# EAGLE schematic MDM_V3_LEDPad_A (EAGLE 6.4)
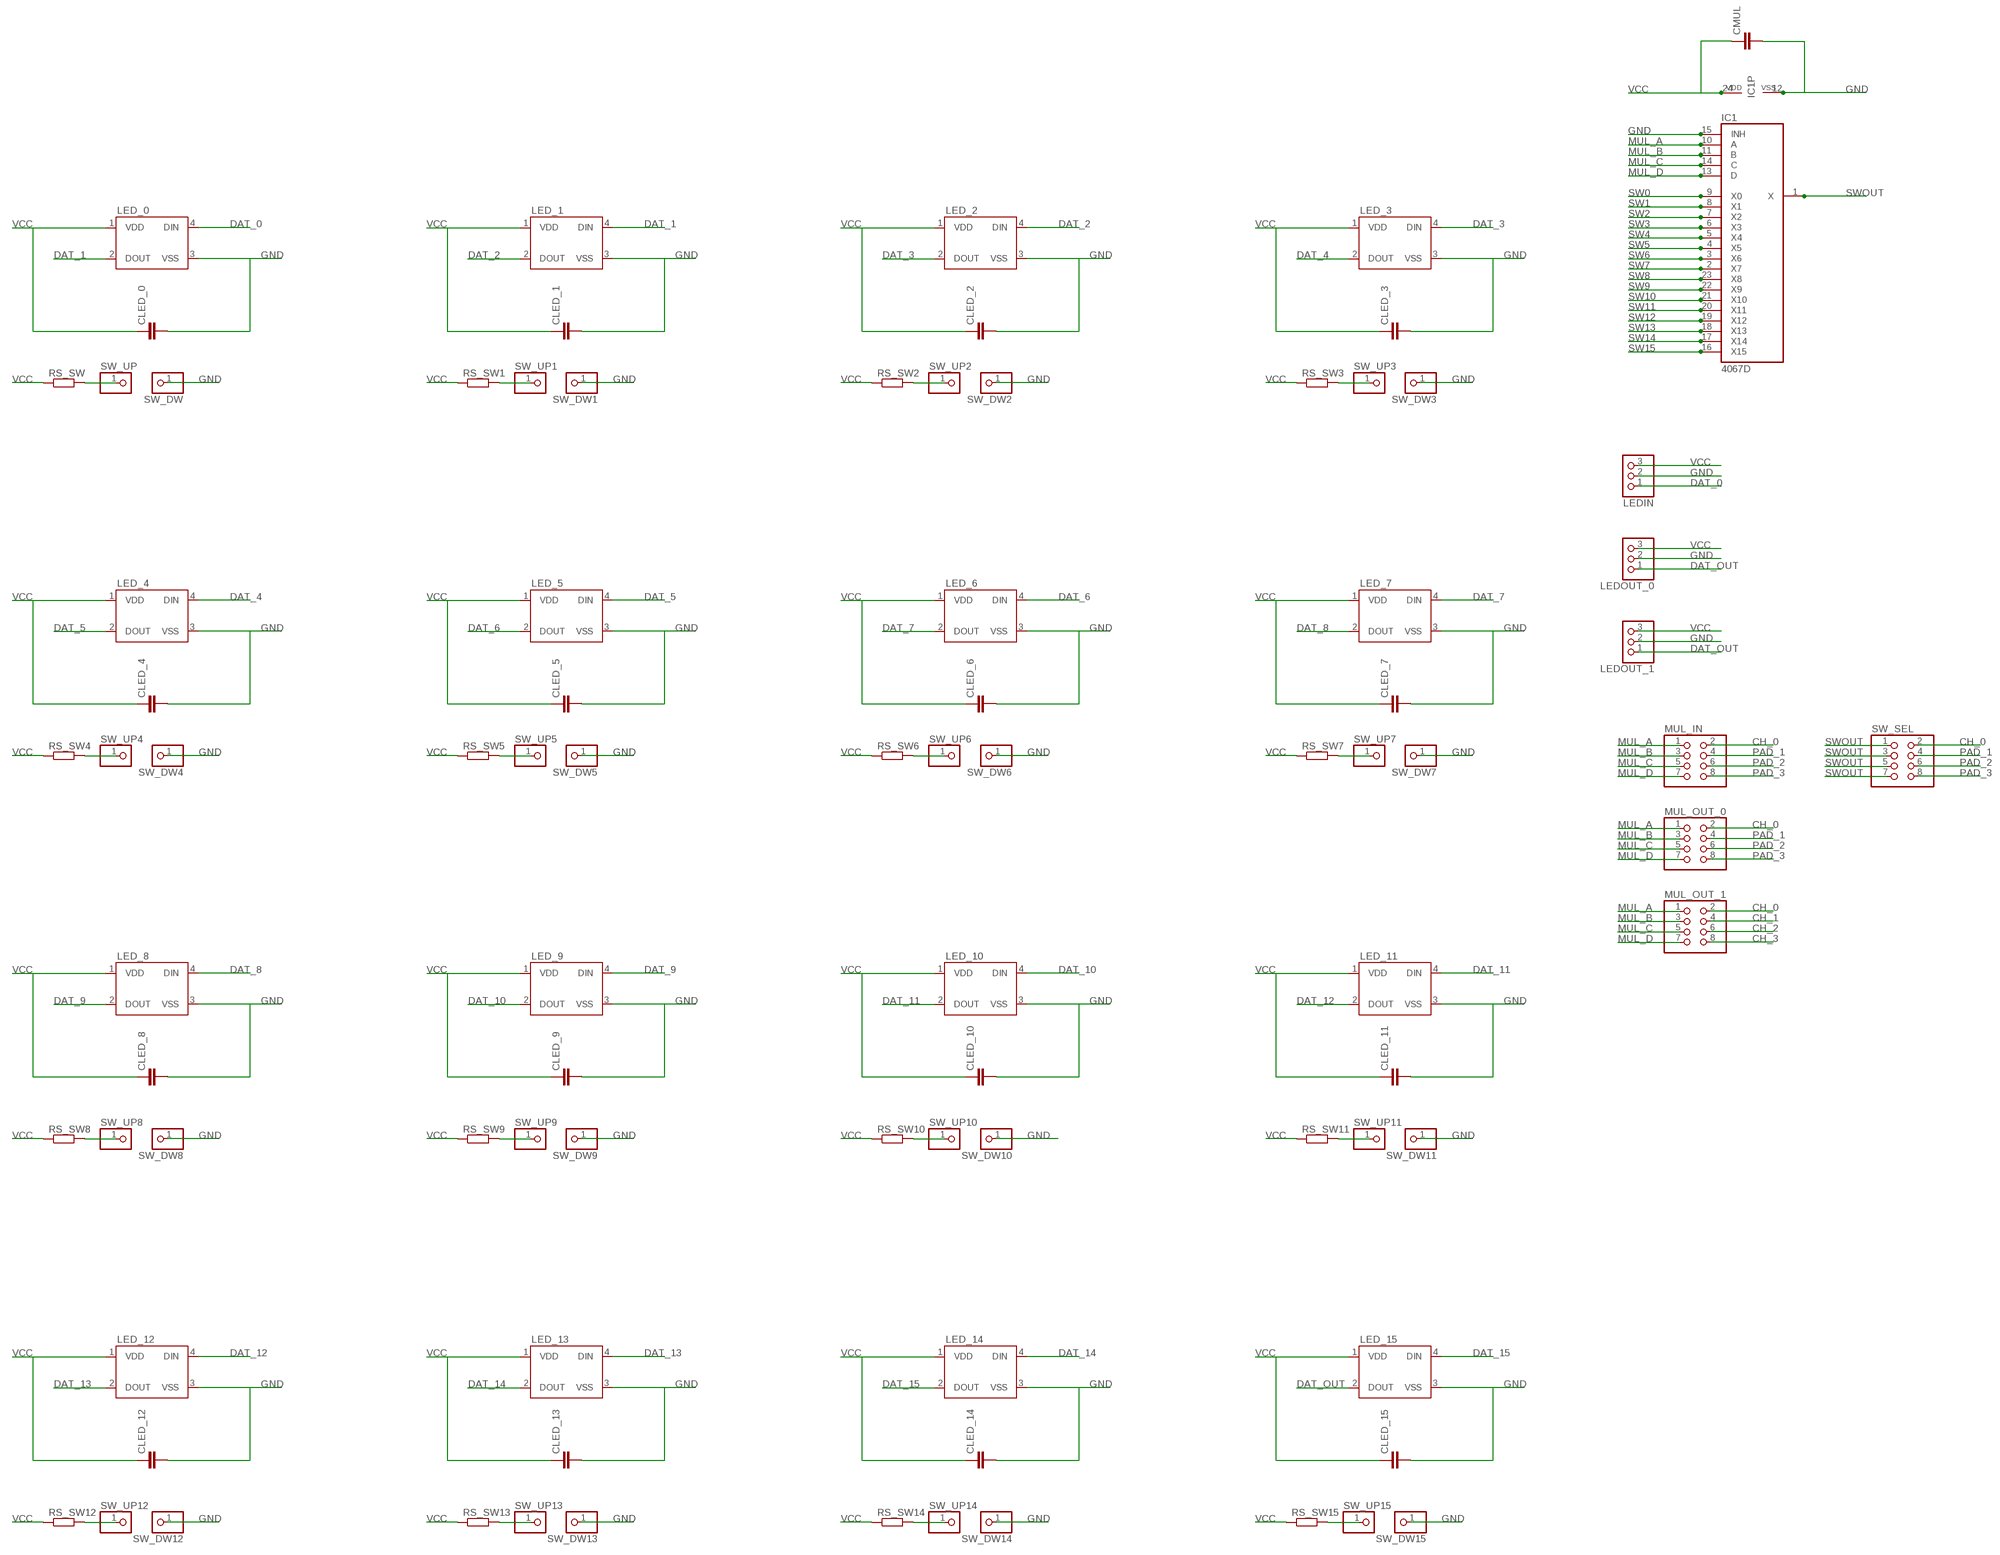
[diagram p0: schematic, sheet 1]

## Parts
CLED_0  C-EUC1206K  [C1206K]
CLED_1  C-EUC1206K  [C1206K]
CLED_2  C-EUC1206K  [C1206K]
CLED_3  C-EUC1206K  [C1206K]
CLED_4  C-EUC1206K  [C1206K]
CLED_5  C-EUC1206K  [C1206K]
CLED_6  C-EUC1206K  [C1206K]
CLED_7  C-EUC1206K  [C1206K]
CLED_8  C-EUC1206K  [C1206K]
CLED_9  C-EUC1206K  [C1206K]
CLED_10  C-EUC1206K  [C1206K]
CLED_11  C-EUC1206K  [C1206K]
CLED_12  C-EUC1206K  [C1206K]
CLED_13  C-EUC1206K  [C1206K]
CLED_14  C-EUC1206K  [C1206K]
CLED_15  C-EUC1206K  [C1206K]
CMUL  C-EUC1206K  [C1206K]
IC1  4067D  [SO24W]
LED_0  WS2812B  [WS2812B]
LED_1  WS2812B  [WS2812B]
LED_2  WS2812B  [WS2812B]
LED_3  WS2812B  [WS2812B]
LED_4  WS2812B  [WS2812B]
LED_5  WS2812B  [WS2812B]
LED_6  WS2812B  [WS2812B]
LED_7  WS2812B  [WS2812B]
LED_8  WS2812B  [WS2812B]
LED_9  WS2812B  [WS2812B]
LED_10  WS2812B  [WS2812B]
LED_11  WS2812B  [WS2812B]
LED_12  WS2812B  [WS2812B]
LED_13  WS2812B  [WS2812B]
LED_14  WS2812B  [WS2812B]
LED_15  WS2812B  [WS2812B]
LEDIN  PINHD-1X3  [1X03]
LEDOUT_0  PINHD-1X3  [1X03]
LEDOUT_1  PINHD-1X3  [1X03]
MUL_IN  PINHD-2X4  [2X04]
MUL_OUT_0  PINHD-2X4  [2X04]
MUL_OUT_1  PINHD-2X4  [2X04]
RS_SW  R-EU_R1206  [R1206]
RS_SW1  R-EU_R1206  [R1206]
RS_SW2  R-EU_R1206  [R1206]
RS_SW3  R-EU_R1206  [R1206]
RS_SW4  R-EU_R1206  [R1206]
RS_SW5  R-EU_R1206  [R1206]
RS_SW6  R-EU_R1206  [R1206]
RS_SW7  R-EU_R1206  [R1206]
RS_SW8  R-EU_R1206  [R1206]
RS_SW9  R-EU_R1206  [R1206]
RS_SW10  R-EU_R1206  [R1206]
RS_SW11  R-EU_R1206  [R1206]
RS_SW12  R-EU_R1206  [R1206]
RS_SW13  R-EU_R1206  [R1206]
RS_SW14  R-EU_R1206  [R1206]
RS_SW15  R-EU_R1206  [R1206]
SW_DW  PINHD-1X1CB  [1X01-CLEANBIG]
SW_DW1  PINHD-1X1CB  [1X01-CLEANBIG]
SW_DW2  PINHD-1X1CB  [1X01-CLEANBIG]
SW_DW3  PINHD-1X1CB  [1X01-CLEANBIG]
SW_DW4  PINHD-1X1CB  [1X01-CLEANBIG]
SW_DW5  PINHD-1X1CB  [1X01-CLEANBIG]
SW_DW6  PINHD-1X1CB  [1X01-CLEANBIG]
SW_DW7  PINHD-1X1CB  [1X01-CLEANBIG]
SW_DW8  PINHD-1X1CB  [1X01-CLEANBIG]
SW_DW9  PINHD-1X1CB  [1X01-CLEANBIG]
SW_DW10  PINHD-1X1CB  [1X01-CLEANBIG]
SW_DW11  PINHD-1X1CB  [1X01-CLEANBIG]
SW_DW12  PINHD-1X1CB  [1X01-CLEANBIG]
SW_DW13  PINHD-1X1CB  [1X01-CLEANBIG]
SW_DW14  PINHD-1X1CB  [1X01-CLEANBIG]
SW_DW15  PINHD-1X1CB  [1X01-CLEANBIG]
SW_SEL  PINHD-2X4  [2X04]
SW_UP  PINHD-1X1CB  [1X01-CLEANBIG]
SW_UP1  PINHD-1X1CB  [1X01-CLEANBIG]
SW_UP2  PINHD-1X1CB  [1X01-CLEANBIG]
SW_UP3  PINHD-1X1CB  [1X01-CLEANBIG]
SW_UP4  PINHD-1X1CB  [1X01-CLEANBIG]
SW_UP5  PINHD-1X1CB  [1X01-CLEANBIG]
SW_UP6  PINHD-1X1CB  [1X01-CLEANBIG]
SW_UP7  PINHD-1X1CB  [1X01-CLEANBIG]
SW_UP8  PINHD-1X1CB  [1X01-CLEANBIG]
SW_UP9  PINHD-1X1CB  [1X01-CLEANBIG]
SW_UP10  PINHD-1X1CB  [1X01-CLEANBIG]
SW_UP11  PINHD-1X1CB  [1X01-CLEANBIG]
SW_UP12  PINHD-1X1CB  [1X01-CLEANBIG]
SW_UP13  PINHD-1X1CB  [1X01-CLEANBIG]
SW_UP14  PINHD-1X1CB  [1X01-CLEANBIG]
SW_UP15  PINHD-1X1CB  [1X01-CLEANBIG]

## Nets
CH_0: MUL_IN.2 MUL_OUT_0.2 MUL_OUT_1.2 SW_SEL.2
CH_1: MUL_OUT_1.4
CH_2: MUL_OUT_1.6
CH_3: MUL_OUT_1.8
DAT_0 [GND]: LED_0.4(DIN) LEDIN.1
DAT_1: LED_0.2(DOUT) LED_1.4(DIN)
DAT_2: LED_1.2(DOUT) LED_2.4(DIN)
DAT_3: LED_2.2(DOUT) LED_3.4(DIN)
DAT_4: LED_3.2(DOUT) LED_4.4(DIN)
DAT_5: LED_4.2(DOUT) LED_5.4(DIN)
DAT_6: LED_5.2(DOUT) LED_6.4(DIN)
DAT_7: LED_6.2(DOUT) LED_7.4(DIN)
DAT_8: LED_7.2(DOUT) LED_8.4(DIN)
DAT_9: LED_8.2(DOUT) LED_9.4(DIN)
DAT_10: LED_9.2(DOUT) LED_10.4(DIN)
DAT_11: LED_10.2(DOUT) LED_11.4(DIN)
DAT_12: LED_11.2(DOUT) LED_12.4(DIN)
DAT_13: LED_12.2(DOUT) LED_13.4(DIN)
DAT_14: LED_13.2(DOUT) LED_14.4(DIN)
DAT_15: LED_14.2(DOUT) LED_15.4(DIN)
DAT_OUT: LED_15.2(DOUT) LEDOUT_0.1 LEDOUT_1.1
GND [GND]: CLED_0.2 CLED_1.2 CLED_2.2 CLED_3.2 CLED_4.2 CLED_5.2 CLED_6.2 CLED_7.2 CLED_8.2 CLED_9.2 CLED_10.2 CLED_11.2 CLED_12.2 CLED_13.2 CLED_14.2 CLED_15.2 CMUL.2 IC1.12(VSS) IC1.15(INH) LED_0.3(VSS) LED_1.3(VSS) LED_2.3(VSS) LED_3.3(VSS) LED_4.3(VSS) LED_5.3(VSS) LED_6.3(VSS) LED_7.3(VSS) LED_8.3(VSS) LED_9.3(VSS) LED_10.3(VSS) LED_11.3(VSS) LED_12.3(VSS) LED_13.3(VSS) LED_14.3(VSS) LED_15.3(VSS) LEDIN.2 LEDOUT_0.2 LEDOUT_1.2 SW_DW1.1 SW_DW2.1 SW_DW3.1 SW_DW4.1 SW_DW5.1 SW_DW6.1 SW_DW7.1 SW_DW8.1 SW_DW9.1 SW_DW10.1 SW_DW11.1 SW_DW12.1 SW_DW13.1 SW_DW14.1 SW_DW15.1 SW_DW.1
MUL_A: IC1.10(A) MUL_IN.1 MUL_OUT_0.1 MUL_OUT_1.1
MUL_B: IC1.11(B) MUL_IN.3 MUL_OUT_0.3 MUL_OUT_1.3
MUL_C: IC1.14(C) MUL_IN.5 MUL_OUT_0.5 MUL_OUT_1.5
MUL_D: IC1.13(D) MUL_IN.7 MUL_OUT_0.7 MUL_OUT_1.7
PAD_1: MUL_IN.4 MUL_OUT_0.4 SW_SEL.4
PAD_2: MUL_IN.6 MUL_OUT_0.6 SW_SEL.6
PAD_3: MUL_IN.8 MUL_OUT_0.8 SW_SEL.8
SW: RS_SW.2 SW_UP.1
SW0: IC1.9(X0)
SW1: IC1.8(X1) RS_SW1.2 SW_UP1.1
SW2: IC1.7(X2) RS_SW2.2 SW_UP2.1
SW3: IC1.6(X3) RS_SW3.2 SW_UP3.1
SW4: IC1.5(X4) RS_SW4.2 SW_UP4.1
SW5: IC1.4(X5) RS_SW5.2 SW_UP5.1
SW6: IC1.3(X6) RS_SW6.2 SW_UP6.1
SW7: IC1.2(X7) RS_SW7.2 SW_UP7.1
SW8: IC1.23(X8) RS_SW8.2 SW_UP8.1
SW9: IC1.22(X9) RS_SW9.2 SW_UP9.1
SW10: IC1.21(X10) RS_SW10.2 SW_UP10.1
SW11: IC1.20(X11) RS_SW11.2 SW_UP11.1
SW12: IC1.19(X12) RS_SW12.2 SW_UP12.1
SW13: IC1.18(X13) RS_SW13.2 SW_UP13.1
SW14: IC1.17(X14) RS_SW14.2 SW_UP14.1
SW15: IC1.16(X15) RS_SW15.2 SW_UP15.1
SWOUT: IC1.1(X) SW_SEL.1 SW_SEL.3 SW_SEL.5 SW_SEL.7
VCC: CLED_0.1 CLED_1.1 CLED_2.1 CLED_3.1 CLED_4.1 CLED_5.1 CLED_6.1 CLED_7.1 CLED_8.1 CLED_9.1 CLED_10.1 CLED_11.1 CLED_12.1 CLED_13.1 CLED_14.1 CLED_15.1 CMUL.1 IC1.24(VDD) LED_0.1(VDD) LED_1.1(VDD) LED_2.1(VDD) LED_3.1(VDD) LED_4.1(VDD) LED_5.1(VDD) LED_6.1(VDD) LED_7.1(VDD) LED_8.1(VDD) LED_9.1(VDD) LED_10.1(VDD) LED_11.1(VDD) LED_12.1(VDD) LED_13.1(VDD) LED_14.1(VDD) LED_15.1(VDD) LEDIN.3 LEDOUT_0.3 LEDOUT_1.3 RS_SW1.1 RS_SW2.1 RS_SW3.1 RS_SW4.1 RS_SW5.1 RS_SW6.1 RS_SW7.1 RS_SW8.1 RS_SW9.1 RS_SW10.1 RS_SW11.1 RS_SW12.1 RS_SW13.1 RS_SW14.1 RS_SW15.1 RS_SW.1

## Library data of the parts
CLED_0 CLED_1-CLED_15 CMUL = resistor:C-EU: CAPACITOR, European symbol
IC1 = 40xx:4067: 16-channel ANALOG MULTIPLEXER
LED_0 LED_1-LED_15 = SparkFun-LED:WS2812B: WS2812B - Intelligent control LED integrated light source Technical Specifications: Power Supply Voltage (VDD): 3.5 to 5.3 V Input Voltage (VI): -0.5 to VDD+0.5 V Operating Junction Temperature (Topt): -25°C to +80°C Storage Temperature Range (Tstg): -55°C to +150°C
LEDIN LEDOUT_0 LEDOUT_1 = adafruit:PINHD-1X3: PIN HEADER
MUL_IN MUL_OUT_0 MUL_OUT_1 SW_SEL = pinhead:PINHD-2X4: PIN HEADER
RS_SW RS_SW1-RS_SW15 = resistor:R-EU_: RESISTOR, European symbol
SW_DW SW_DW1-SW_DW15 SW_UP SW_UP1-SW_UP15 = adafruit:PINHD-1X1: Pin header 1x1 for 0.1" spacing With round pins

## Net classes
1 GND: width 0.508 mm, clearance 0.254 mm